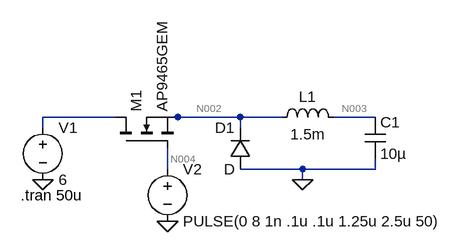
[diagram p0: schematic buck converter.asc]
buck converter.asc, the LTspice schematic file:
Version 4
SHEET 1 880 680
WIRE 160 144 48 144
WIRE 256 144 240 144
WIRE 352 144 256 144
WIRE 416 144 352 144
WIRE 560 144 496 144
WIRE 48 160 48 144
WIRE 352 160 352 144
WIRE 240 224 240 192
WIRE 448 224 352 224
WIRE 560 224 560 208
WIRE 560 224 448 224
WIRE 448 240 448 224
FLAG 48 240 0
FLAG 240 304 0
FLAG 448 240 0
SYMBOL cap 544 144 R0
SYMATTR InstName C1
SYMATTR Value 10µ
SYMBOL ind 400 160 R270
WINDOW 0 32 56 VTop 2
WINDOW 3 5 56 VBottom 2
SYMATTR InstName L1
SYMATTR Value 1.5m
SYMBOL diode 368 224 R180
WINDOW 0 24 64 Left 2
WINDOW 3 24 0 Left 2
SYMATTR InstName D1
SYMBOL voltage 48 144 R0
WINDOW 123 0 0 Left 2
WINDOW 39 0 0 Left 2
SYMATTR InstName V1
SYMATTR Value 6
SYMBOL voltage 240 208 R0
WINDOW 123 0 0 Left 2
WINDOW 39 0 0 Left 2
SYMATTR InstName V2
SYMATTR Value PULSE(0 8 1n .1u .1u 1.25u 2.5u 50)
SYMBOL nmos 160 192 R270
SYMATTR InstName M1
SYMATTR Value AP9465GEM
TEXT 14 264 Left 2 !.tran 50u

The netlist it stands for:
* buck converter.asc
C1 N003 0 10µ
L1 N002 N003 1.5m
D1 0 N002 D
V1 N001 0 6
V2 N004 0 PULSE(0 8 1n .1u .1u 1.25u 2.5u 50)
M1 N001 N004 N002 N002 AP9465GEM
.model D D
.lib standard.dio
.model NMOS NMOS
.model PMOS PMOS
.lib standard.mos
.tran 50u
.backanno
.end

* Results of the author's LTspice run, read from the files saved beside the schematic
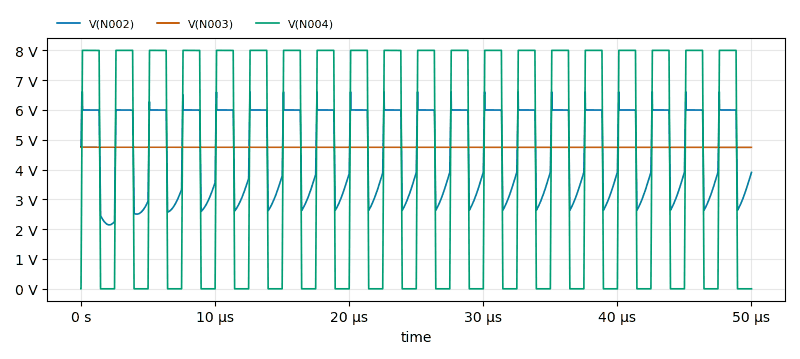
[diagram p1: Transient Analysis of buck converter.asc, plotted from the saved traces]
* Transient Analysis, 1 run:
*   V(N002): min 2.144 V, max 6.61 V, average 4.691 V, rms 4.911 V, last 3.907 V
*   V(N003): min 4.746 V, max 4.752 V, average 4.749 V, rms 4.749 V, last 4.746 V
*   V(N004): min 0 V, max 8 V, average 4.32 V, rms 5.807 V, last 0 V